# Altium schematic sheet Sheet_20190224.SchDoc
size A2
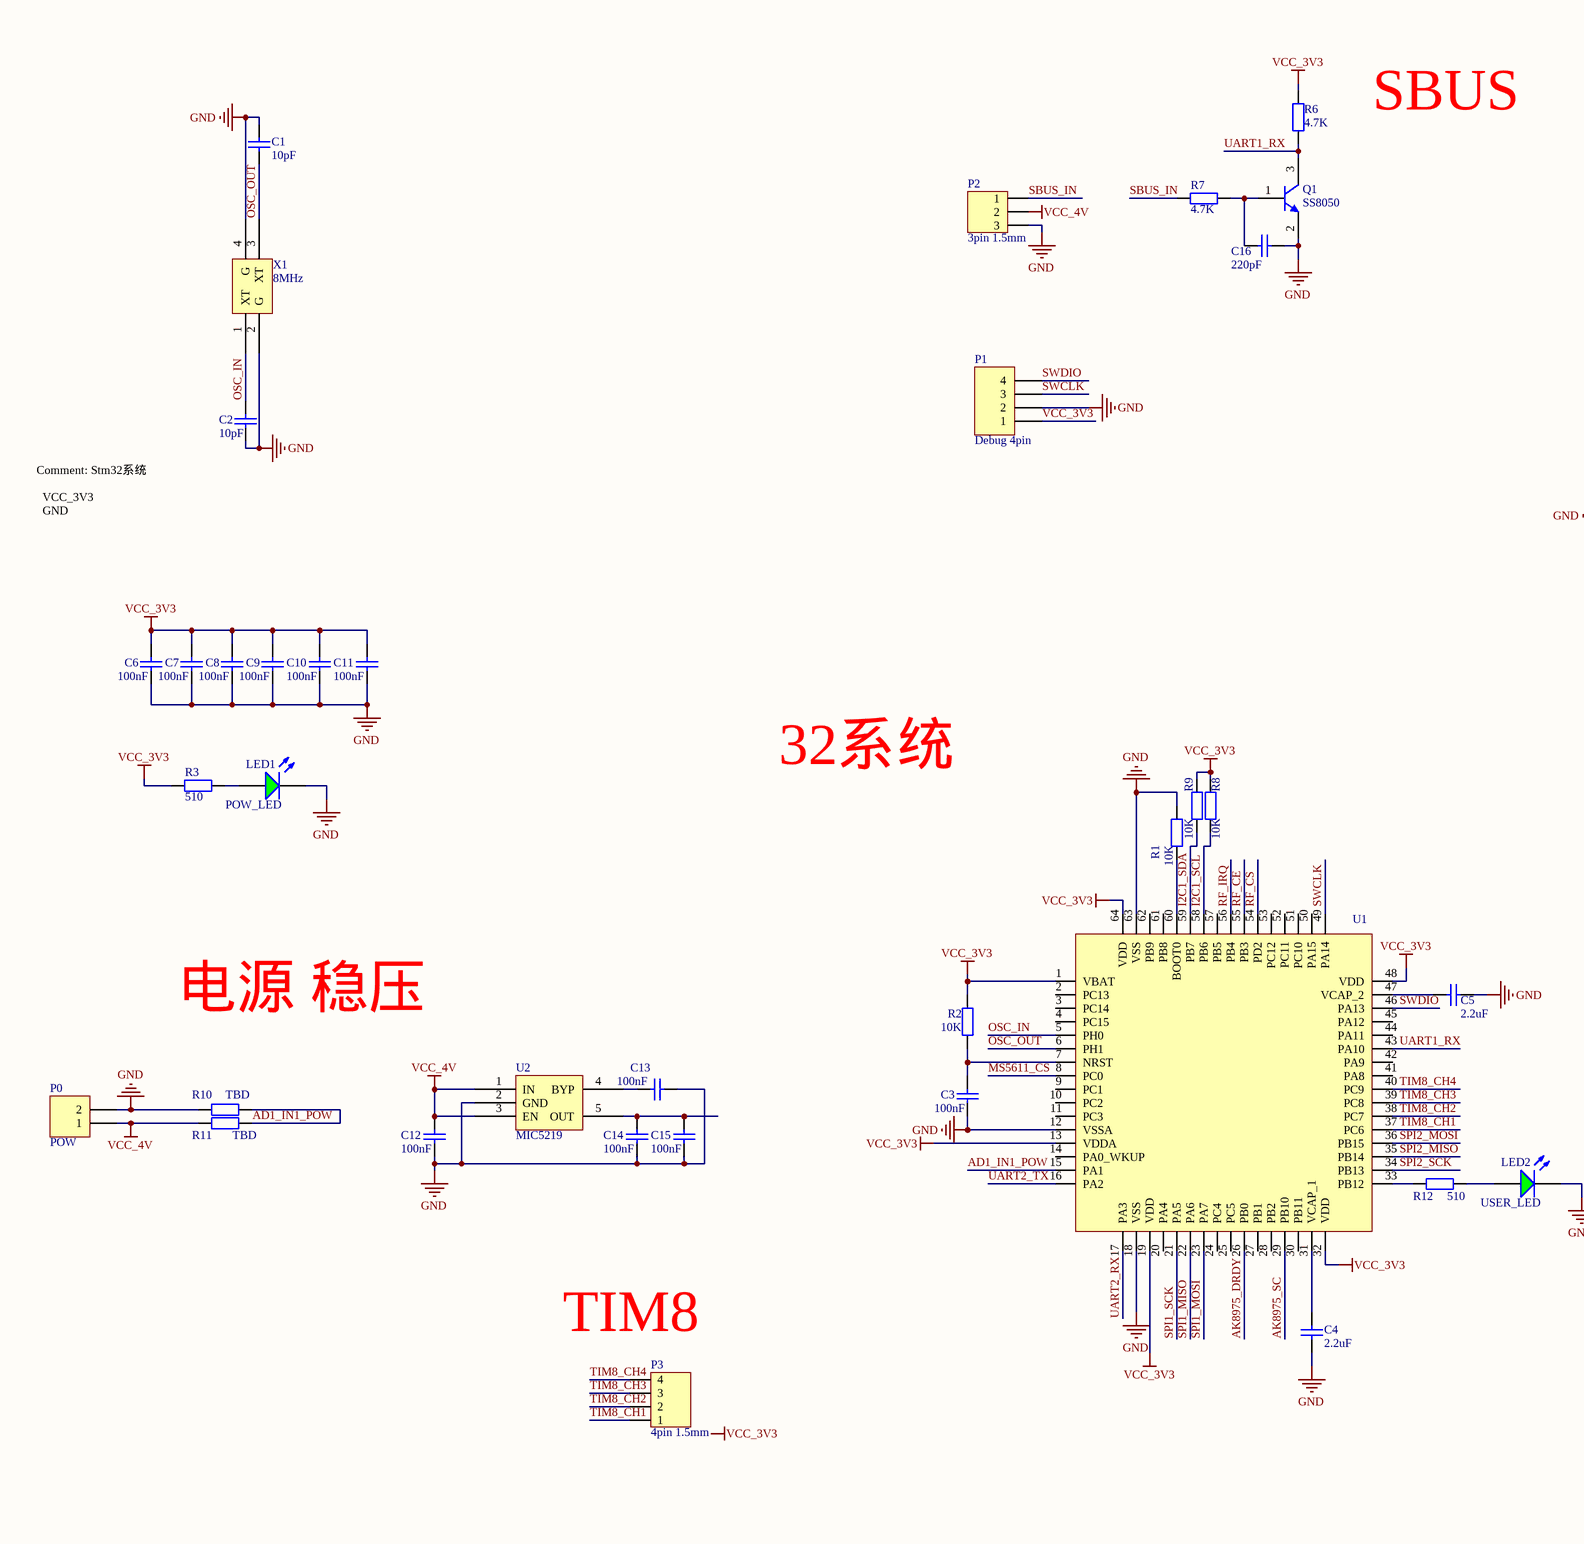
[diagram p0: Sheet_20190224.SchDoc, left]
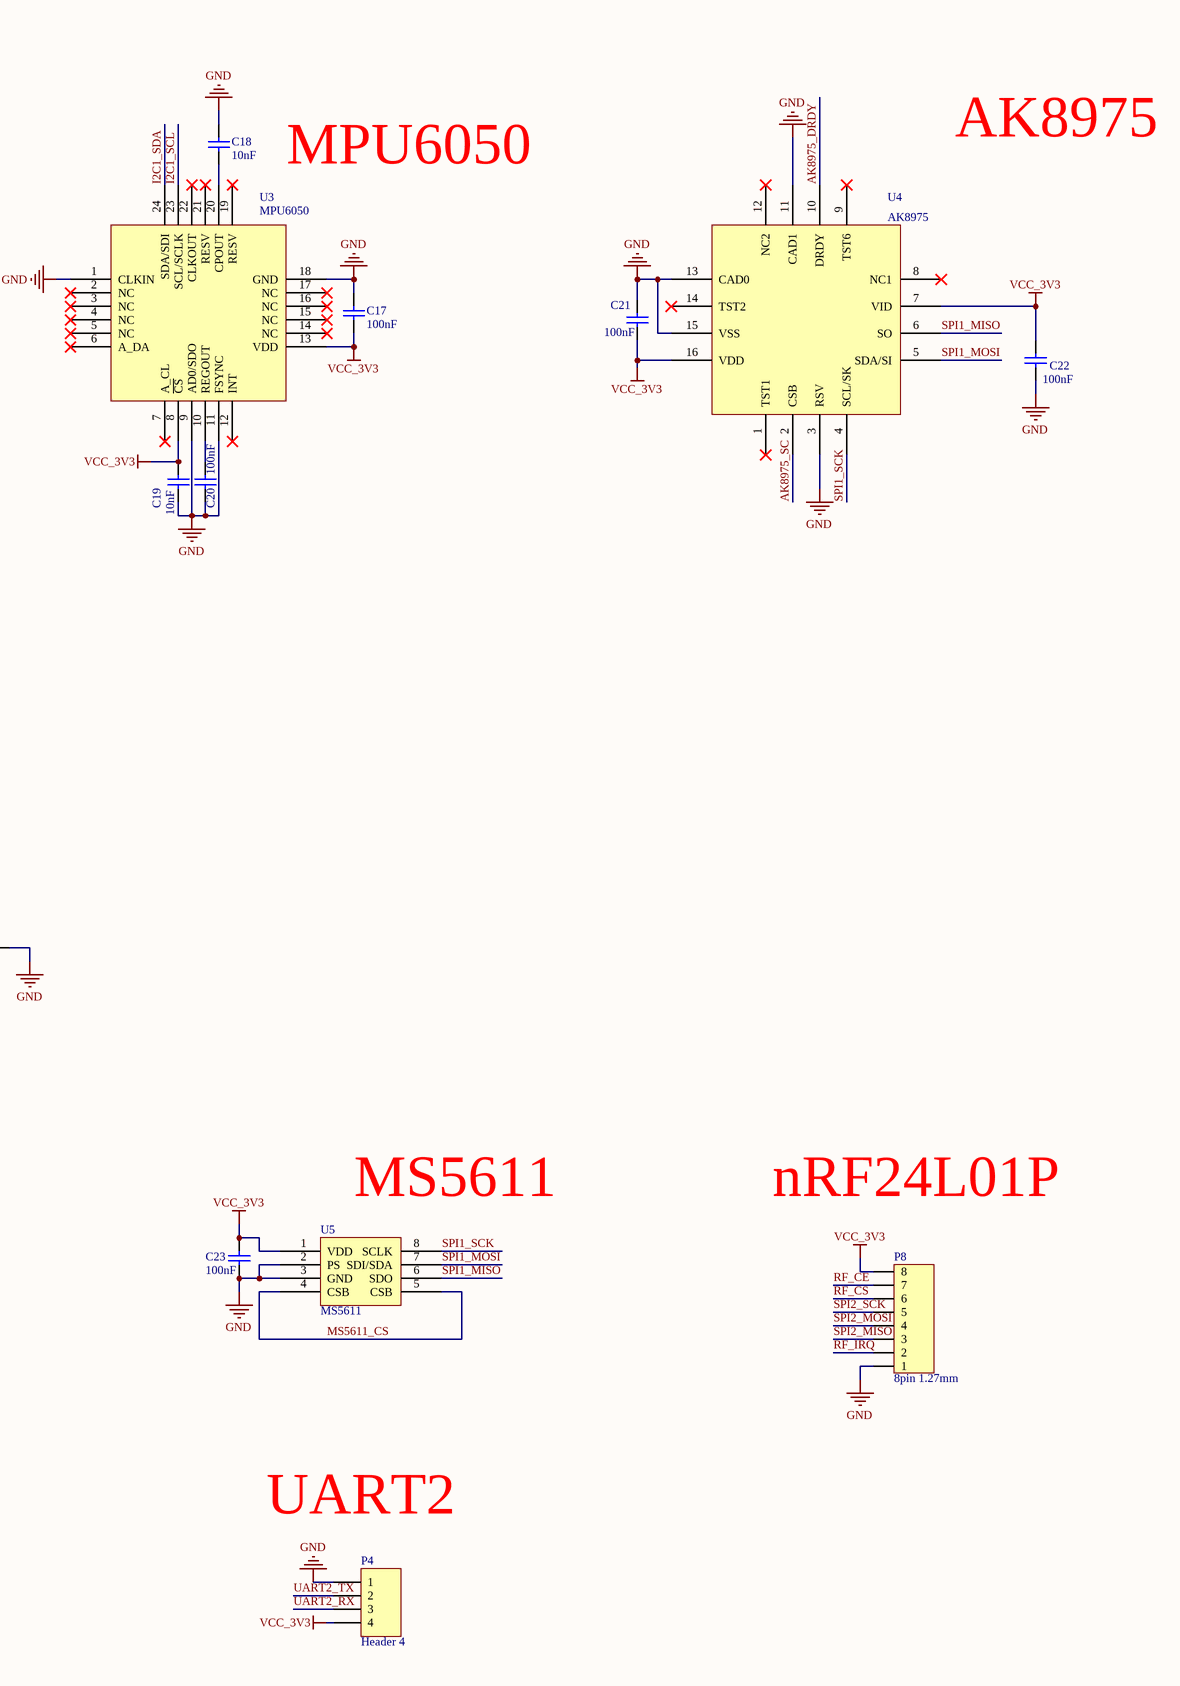
[diagram p1: Sheet_20190224.SchDoc, right]

## Parts
C1  10pF  [0402 C]
C2  10pF  [0402 C]
C3  100nF  [0402 C]
C4  2.2uF  [0603 C]
C5  2.2uF  [0603 C]
C6  100nF  [0402 C]
C7  100nF  [0402 C]
C8  100nF  [0402 C]
C9  100nF  [0402 C]
C10  100nF  [0402 C]
C11  100nF  [0402 C]
C12  100nF  [0402 C]
C13  100nF  [0402 C]
C14  100nF  [0402 C]
C15  100nF  [0402 C]
C16  220pF  [0402 C]
C17  100nF  [0402 C]
C18  10nF  [0402 C]
C19  10nF  [0402 C]
C20  100nF  [0402 C]
C21  100nF  [0402 C]
C22  100nF  [0402 C]
C23  100nF  [0402 C]
LED1  POW_LED  [0603 LED]
LED2  USER_LED  [0603 LED]
P0  POW  [HDR1X2]
P1  Debug 4pin  [GH-1.25 4pin]
P2  3pin 1.5mm  [3pin 1.5mm]
P3  4pin 1.5mm  [4pin 1.5mm]
P4  Header 4  [HDR1X4]
P8  8pin 1.27mm  [8pin 1.27mm]
Q1  SS8050  [SOT-23 3pin]
R1  10K  [0402 R]
R2  10K  [0402 R]
R3  510  [0402 R]
R6  4.7K  [0402 R]
R7  4.7K  [0402 R]
R8  10K  [0402 R]
R9  10K  [0402 R]
R10  TBD  [0402 R]
R11  TBD  [0402 R]
R12  510  [0402 R]
U1  STM32F407VET6_64  [LQFP 64pin]  (value not drawn)
U2  MIC5219  [SOT-23 5pin]
U3  MPU6050  [QFN 24pin]
U4  AK8975  [AK8975]
U5  MS5611  [MS5611]
X1  8MHz  [XTAL_3225 4pin]

## Nets
GND: C1.2 C2.1 C3.1 C4.1 C5.1 C6.1 C7.1 C8.1 C9.1 C10.1 C11.1 C12.1 C13.1 C14.1 C15.1 C16.1 C17.1 C18.1 C19.2 C20.2 C21.1 C22.2 C23.1 LED1.K LED2.K P0.2 P1.2 P2.3 P4.1 P8.1 Q1.2(E) R1.2 R10.1 U1.12(VSSA) U1.18(VSS) U1.63(VSS) U2.2(GND) U3.1(CLKIN) U3.9(AD0/SDO) U3.11(FSYNC) U3.18(GND) U4.3(RSV) U4.11(CAD1) U4.13(CAD0) U4.15(VSS) U5.2(PS) U5.3(GND) X1.2(G) X1.4(G)
VCC_3V3: C6.2 C7.2 C8.2 C9.2 C10.2 C11.2 C17.2 C19.1 C21.2 C22.1 C23.2 P1.1 P4.4 P8.8 R2.2 R3.2 R6.1 R8.1 R9.1 U1.1(VBAT) U1.13(VDDA) U1.19(VDD) U1.32(VDD) U1.48(VDD) U1.64(VDD) U3.8(~{CS}) U3.13(VDD) U4.7(VID) U4.16(VDD) U5.1(VDD)
VCC_4V: C12.2 P0.1 P2.2 R11.1 U2.1(IN) U2.3(EN)
AD1_IN1_POW: R10.2 R11.2 U1.15(PA1)
AK8975_DRDY: U1.26(PB0) U4.10(DRDY)
AK8975_SC: U1.29(PB10) U4.2(CSB)
I2C1_SCL: R8.2 U1.58(PB6) U3.23(SCL/SCLK)
I2C1_SDA: R9.2 U1.59(PB7) U3.24(SDA/SDI)
MS5611_CS: U1.8(PC0) U5.4(CSB) U5.5(CSB)
OSC_IN: C2.2 U1.5(PH0) X1.1(XT)
OSC_OUT: C1.1 U1.6(PH1) X1.3(XT)
RF_CE: P8.7 U1.55(PB3)
RF_CS: P8.6 U1.54(PD2)
RF_IRQ: P8.2 U1.56(PB4)
SBUS_IN: P2.1 R7.2
SPI1_MISO: U1.22(PA6) U4.6(SO) U5.6(SDO)
SPI1_MOSI: U1.23(PA7) U4.5(SDA/SI) U5.7(SDI/SDA)
SPI1_SCK: U1.21(PA5) U4.4(SCL/SK) U5.8(SCLK)
SPI2_MISO: P8.3 U1.35(PB14)
SPI2_MOSI: P8.4 U1.36(PB15)
SPI2_SCK: P8.5 U1.34(PB13)
SWCLK: P1.3 U1.49(PA14)
SWDIO: P1.4 U1.46(PA13)
TIM8_CH1: P3.1 U1.37(PC6)
TIM8_CH2: P3.2 U1.38(PC7)
TIM8_CH3: P3.3 U1.39(PC8)
TIM8_CH4: P3.4 U1.40(PC9)
UART1_RX: Q1.3(C) R6.2 U1.43(PA10)
UART2_RX: P4.3 U1.17(PA3)
UART2_TX: P4.2 U1.16(PA2)
NetC3_2: C3.2 R2.1 U1.7(NRST)
NetC4_2: C4.2 U1.31(VCAP_1)
NetC5_2: C5.2 U1.47(VCAP_2)
NetC13_2: C13.2 U2.4(BYP)
NetC14_2: C14.2 C15.2 U2.5(OUT)
NetC16_2: C16.2 Q1.1(B) R7.1
NetC18_2: C18.2 U3.20(CPOUT)
NetC20_1: C20.1 U3.10(REGOUT)
NetLED1_A: LED1.A R3.1
NetLED2_A: LED2.A R12.2
NetR1_1: R1.1 U1.60(BOOT0)
NetR12_1: R12.1 U1.33(PB12)

Not connected (* = marked no-connect by the designer): U1 2(PC13) 3(PC14) 4(PC15) 9(PC1) 10(PC2) 11(PC3) 14(PA0_WKUP) 20(PA4) 24(PC4) 25(PC5) 27(PB1) 28(PB2) 30(PB11) 41(PA8) 42(PA9) 44(PA11) 45(PA12) 50(PA15) 51(PC10) 52(PC11) 53(PC12) 57(PB5) 61(PB8) 62(PB9); U3 2(NC)* 3(NC)* 4(NC)* 5(NC)* 6(A_DA)* 7(A_CL)* 12(INT)* 14(NC)* 15(NC)* 16(NC)* 17(NC)* 19(RESV)* 21(RESV)* 22(CLKOUT)*; U4 1(TST1)* 8(NC1)* 9(TST6)* 12(NC2)* 14(TST2)*

## Notes on the sheet
- SBUS
- MPU6050
- AK8975
- Comment: Stm32系统
  VCC_3V3
  GND
- 32系统
- 电源 稳压
- (near P3) TIM8
- (near U5) MS5611
- nRF24L01P
- UART2
- Labels drawn without touching a wire or pin: VCC_3V3

## Library data of the parts
C1-C3 C6-C23 = 0402 C
C4 C5 = 0603 C
LED1 LED2 = 0603 LED
P0 = Header 2: Header, 2-Pin; LatestRevisionDate: 17-Jul-2002; LatestRevisionNote: Re-released for DXP Platform.; Publisher: Altium Limited
P4 = Header 4: Header, 4-Pin; LatestRevisionDate: 17-Jul-2002; LatestRevisionNote: Re-released for DXP Platform.; Publisher: Altium Limited
R1-R3 R6-R12 = 0402 R
U3 = MPU6000/6050
X1 = XTAL